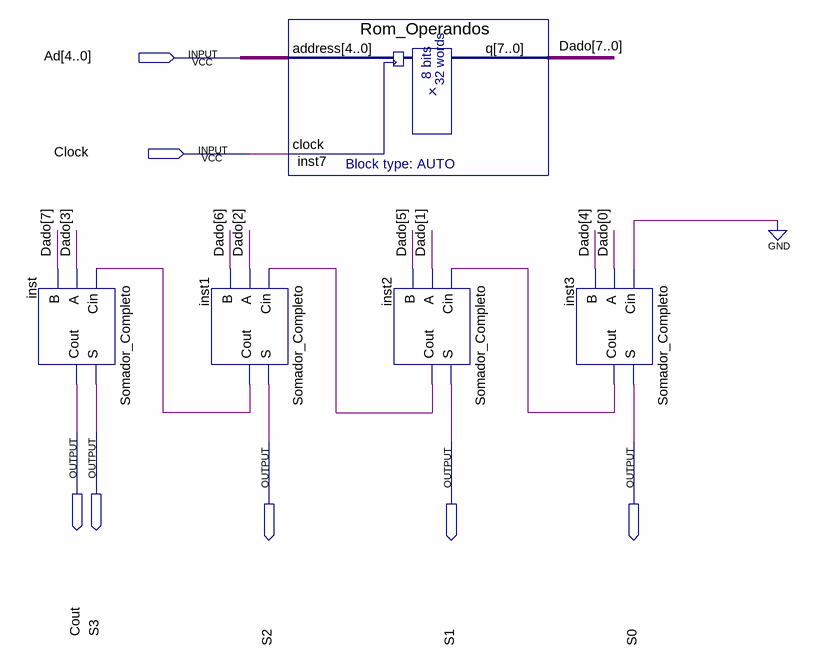
[diagram p0: schematic sheet]
// Quartus schematic Somador_4_bits.bdf as structural Verilog: 5 symbols, 7 pins
module Somador_4_bits (
  input  [4:0] Ad,
  input  Clock,
  output Cout,
  output S3,
  output S2,
  output S1,
  output S0
);

  wire inst1_cout, inst2_cout, inst3_cout;
  wire [7:0] Dado;

  Somador_Completo inst (.Cin(inst1_cout), .A(Dado[3]), .B(Dado[7]), .S(S3), .Cout(Cout));
  Somador_Completo inst1 (.Cin(inst2_cout), .A(Dado[2]), .B(Dado[6]), .S(S2), .Cout(inst1_cout));
  Rom_Operandos inst7 (.address(Ad), .clock(Clock), .q(Dado));
  Somador_Completo inst2 (.Cin(inst3_cout), .A(Dado[1]), .B(Dado[5]), .S(S1), .Cout(inst2_cout));
  Somador_Completo inst3 (.Cin(1'b0), .A(Dado[0]), .B(Dado[4]), .S(S0), .Cout(inst3_cout));
endmodule
